# EasyEDA Pro project PCB3.epro

# Board PCB3
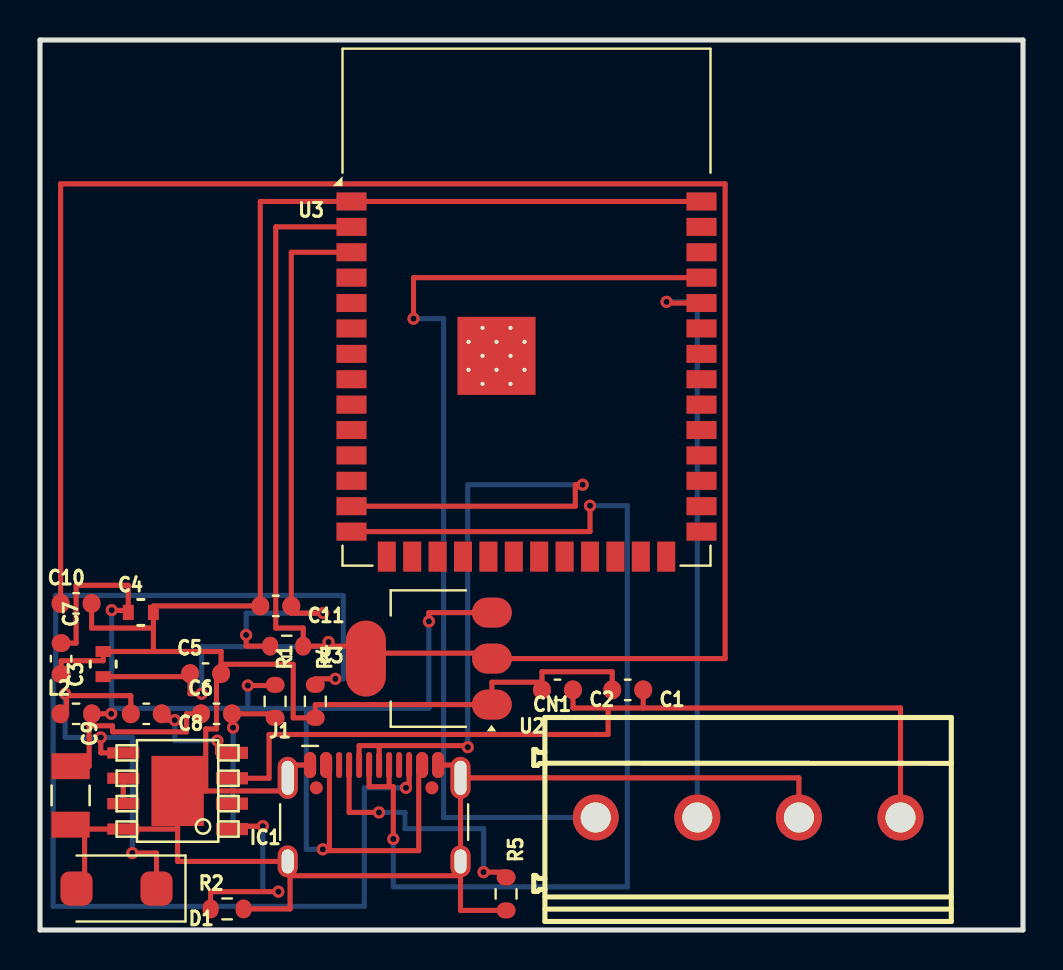
[diagram p0: board, top side]
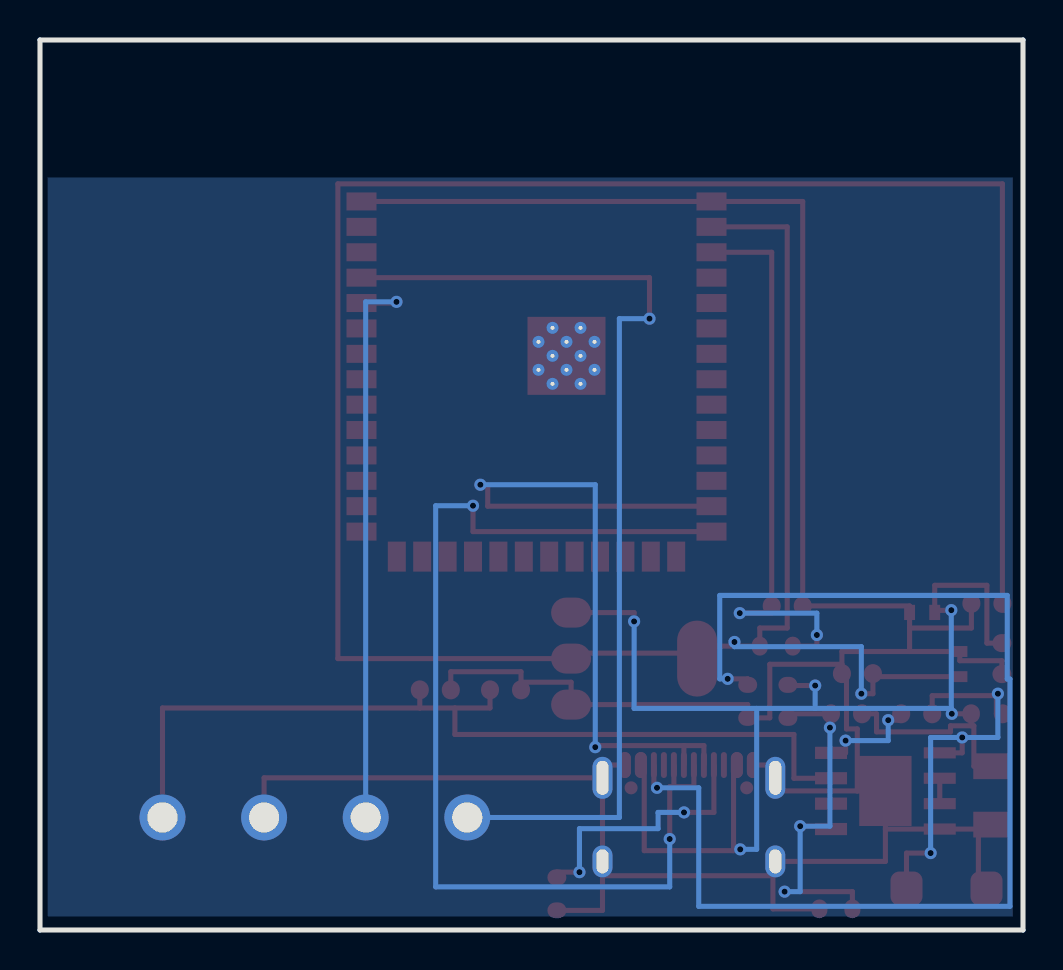
[diagram p1: board, bottom side, seen from below]

Outline 49.15 x 44.51 mm; copper layers: Top Layer, Bottom Layer. Coordinates in mm from the lower left corner of the outline.
Outline path: 0,44.51 49.15,44.51 49.15,0 0,0 0,44.51
Stack: Top Layer 0.035mm / Dielectric1 1.51mm FR4 er 4.5 / Bottom Layer 0.035mm

## Design rules (mm)
template: Custom Config
spacing copperThickness1oz (default): track to track 0.102, other pairs 0.1 to 0.3
spacing copperThickness2oz: track to track 0.203, other pairs 0.152 to 0.3
track width copperThickness1oz (default): min 0.127, default 0.254, max 2.54
track width copperThickness2oz: min 0.203, default 0.254, max 2.54
differential pair differentialPair (default): width min 0.127, default 0.254, max 2.54; gap min 0.152, default 0.152
via viaSize (default): diameter min 0.5, default 0.61, max 10; hole min 0.3, default 0.305, max 6.3

## Placement (name value [footprint] x y rotation side)
C1  -  [Capacitor_SMD:C_0603_1608Metric]  29.38 12.01 180 top
C2  -  [Capacitor_SMD:C_0603_1608Metric]  25.87 12.01 180 top
C3  -  [CAP:CAP_A106MMUAJ6_AVX]  3.16 13.3 90 top
C4  -  [CAP:CAP_A106MMUAJ6_AVX]  5.04 15.88 0 top
C5  -  [Capacitor_SMD:C_0603_1608Metric]  8.28 12.82 0 top
C6  -  [Capacitor_SMD:C_0603_1608Metric]  8.82 10.81 0 top
C7  -  [Capacitor_SMD:C_0603_1608Metric]  1.06 13.57 270 top
C8  -  [Capacitor_SMD:C_0603_1608Metric]  5.31 10.81 180 top
C9  -  [CAP:CAPC3216X190N]  1.53 6.73 270 top
C10  -  [Capacitor_SMD:C_0603_1608Metric]  1.81 16.33 0 top
C11  -  [Capacitor_SMD:C_0603_1608Metric]  11.79 16.2 180 top
CN1  DB128V-5.08-4P-GN-S  [CONN-TH_4P-P5.08_DIBO_DB128V-5.08]  35.41 5.63 0 top
D1  -  [DIODE:P25_DO-214AC_SMA]  5.83 2.07 180 top
IC1  -  [Buck convertor:SOIC-8EP]  6.88 6.95 180 top
J1  -  [Connector_USB:USB_C_Receptacle_HCTL_HC-TYPE-C-16P-01A]  16.71 4.5 0 top
L2  -  [Inductor_SMD:L_0603_1608Metric]  1.81 10.81 0 top
R1  -  [Resistor_SMD:R_0603_1608Metric]  11.75 11.43 270 top
R2  -  [Resistor_SMD:R_0603_1608Metric]  9.35 1.06 0 top
R3  -  [Resistor_SMD:R_0603_1608Metric]  12.34 14.19 180 top
R4  -  [Resistor_SMD:R_0603_1608Metric]  13.76 11.43 270 top
R5  -  [Resistor_SMD:R_0603_1608Metric]  23.31 1.8 270 top
U2  -  [Package_TO_SOT_SMD:SOT-223-3_TabPin2]  19.44 13.57 180 top
U3  -  [RF_Module:ESP32-S3-WROOM-1]  24.32 31.17 0 top

## Footprints (pads in the part's own frame, mm; a bottom-side part is the same pattern mirrored in y, then rotated)
Buck convertor:SOIC-8EP
  rect 1.6x0.61 smd: 1(-2.718,1.905) 2(-2.718,0.635) 3(-2.718,-0.635) 4(-2.718,-1.905)
  rect 1.6x0.559 smd: 5(2.718,-1.905) 6(2.718,-0.635) 7(2.718,0.635) 8(2.718,1.905)
  rect 2.616x3.505 smd: 9(0,0)
CAP:CAP_A106MMUAJ6_AVX
  rect 0.546x0.762 smd: 1(-0.628,0) 2(0.628,0)
CAP:CAPC3216X190N
  rect 1.29x1.91 smd: 1(-1.46,0) 2(1.46,0)
Capacitor_SMD:C_0603_1608Metric
  rrect 0.9x0.95 smd: 1(-0.775,0) 2(0.775,0)
CONN-TH_4P-P5.08_DIBO_DB128V-5.08
  round 2.3 hole 1.5: 1(-7.62,0) 2(-2.54,0) 3(2.54,0) 4(7.62,0)
Connector_USB:USB_C_Receptacle_HCTL_HC-TYPE-C-16P-01A
  round 0.65 smd: (-2.89,2.605) (2.89,2.605)
  rrect 0.6x1.3 smd: A1(-3.2,3.745) A4(-2.4,3.745) A9(2.4,3.745) A12(3.2,3.745) B1(3.2,3.745) B4(2.4,3.745) B9(-2.4,3.745) B12(-3.2,3.745)
  rrect 0.3x1.3 smd: A5(-1.25,3.745) A6(-0.25,3.745) A7(0.25,3.745) A8(1.25,3.745) B5(1.75,3.745) B6(0.75,3.745) B7(-0.75,3.745) B8(-1.75,3.745)
  oval 1x2.1 hole 0.6x1.7: S1(-4.32,3.105) S1(4.32,3.105)
  oval 1x1.6 hole 0.6x1.2: S1(-4.32,-1.075) S1(4.32,-1.075)
DIODE:P25_DO-214AC_SMA
  rrect 1.6x1.7 smd: 1(0,0) 2(4,0)
Inductor_SMD:L_0603_1608Metric
  rrect 0.875x0.95 smd: 1(-0.787,0) 2(0.787,0)
Package_TO_SOT_SMD:SOT-223-3_TabPin2
  rrect 2x1.5 smd: 1(-3.15,2.3) 2(-3.15,0) 3(-3.15,-2.3)
  rrect 2x3.8 smd: 2(3.15,0)
Resistor_SMD:R_0603_1608Metric
  rrect 0.8x0.95 smd: 1(-0.825,0) 2(0.825,0)
RF_Module:ESP32-S3-WROOM-1
  rect 0.9x0.9 smd: (-2.9,-1.06) (-2.9,-2.46) (-2.9,-3.86) (-1.5,-1.06) (-1.5,-2.46) (-1.5,-3.86) (-0.1,-1.06) (-0.1,-2.46) (-0.1,-3.86)
  rect 1.5x0.9 smd: 1(-8.75,5.26) 2(-8.75,3.99) 3(-8.75,2.72) 4(-8.75,1.45) 5(-8.75,0.18) 6(-8.75,-1.09) 7(-8.75,-2.36) 8(-8.75,-3.63) 9(-8.75,-4.9) 10(-8.75,-6.17) 11(-8.75,-7.44) 12(-8.75,-8.71) 13(-8.75,-9.98) 14(-8.75,-11.25) 27(8.75,-11.25) 28(8.75,-9.98) 29(8.75,-8.71) 30(8.75,-7.44) 31(8.75,-6.17) 32(8.75,-4.9) 33(8.75,-3.63) 34(8.75,-2.36) 35(8.75,-1.09) 36(8.75,0.18) 37(8.75,1.45) 38(8.75,2.72) 39(8.75,3.99) 40(8.75,5.26)
  rect 0.9x1.5 smd: 15(-6.985,-12.5) 16(-5.715,-12.5) 17(-4.445,-12.5) 18(-3.175,-12.5) 19(-1.905,-12.5) 20(-0.635,-12.5) 21(0.635,-12.5) 22(1.905,-12.5) 23(3.175,-12.5) 24(4.445,-12.5) 25(5.715,-12.5) 26(6.985,-12.5)
  round 0.6 hole 0.2: 41(-2.9,-1.76) 41(-2.9,-3.16) 41(-2.2,-1.06) 41(-2.2,-2.46) 41(-2.2,-3.86) 41(-1.5,-1.76) 41(-1.5,-3.16) 41(-0.8,-1.06) 41(-0.8,-2.46) 41(-0.8,-3.86) 41(-0.1,-1.76) 41(-0.1,-3.16)
  rect 3.9x3.9 smd: 41(-1.5,-2.46)

## Nets
5V_SUP: C4.1 C6.1 C7.1 C9.1 J1.A4 J1.A9 J1.B4 J1.B9 L2.2 R1.1 U2.3
D+: J1.A6 J1.B6 U3.14
D-: J1.A7 J1.B7 U3.13
EN: C11.1 R3.2 U3.3
POWER_+3V3: C3.1 C5.1 C10.1 R3.1 U2.2 U3.2
POWER_GND: C1.2 C2.2 C3.2 C4.2 C5.2 C7.2 C9.2 C10.2 C11.2 CN1.3 D1.2 IC1.8 IC1.9 J1.A1 J1.A12 J1.B1 J1.B12 J1.S1 R2.2 R4.2 R5.2 U2.1 U3.1 U3.40 U3.41
$1N4: C8.2 D1.1 IC1.5 L2.1
$1N6: C1.1 C2.1 CN1.4 IC1.3
$1N11: IC1.6 IC1.7
$1N14: CN1.1 U3.37
$1N16: CN1.2 U3.36
$1N23: C6.2 IC1.1 R1.2 R2.1
$1N25: C8.1 IC1.4
$1N30: J1.A5 R5.1
$1N40: J1.B5 R4.1

Pads without a net: IC1 2; J1 A8 B8; U3 4 5 6 7 8 9 10 11 12 15 16 17 18 19 20 21 22 23 24 25 26 27 28 29 30 31 32 33 34 35 38 39

## Via types
v1: diameter 0.61, hole 0.305, Top Layer to Bottom Layer, 27 vias

## Routing (per net, layer and track width the routed paths; a pad name or vN(x,y) marks a point on that pad's centre or on a via; arc(x,y) is an arc through that point)
5V_SUP: length 72.9
  Top Layer w0.254: U2.3 19.44,15.87 v1(19.44,15.43) ; v1(10.39,12.22) 11.75,12.22 R1.1 ; C6.1 7.32,10.81 7.32,9.91 3.62,9.91 3.62,10.21 2.59,10.21 ; 19.1,8.25 18.94,8.25 18.94,3.97 14.47,3.97 14.47,4.03 ; 4.41,15.98 3.58,15.98 v1(3.58,16) ; 4.41,15.98 4.41,15.88 ; 4.41,15.98 4.41,17.24 1.81,17.24 1.81,14.35 C7.1 ; 2.59,10.21 2.46,10.21 2.46,8.19 C9.1 ; 2.59,10.21 L2.2 v1(3.56,10.81) ; 14.47,4.03 14.47,8.25 J1.A4 ; 14.47,4.03 v1(14.14,4.03)
  Bottom Layer w0.254: 3.58,11.08 10.39,11.08 ; 3.58,11.08 v1(3.58,16) ; 3.58,11.08 3.58,10.81 v1(3.56,10.81) ; 10.39,11.08 13.32,11.08 ; 10.39,11.08 v1(10.39,12.22) ; 13.32,11.08 19.44,11.08 v1(19.44,15.43) ; 13.32,11.08 13.32,4.03 v1(14.14,4.03)
D+: length 54.2
  Top Layer w0.254: v1(17.66,4.55) 17.66,7.17 17.46,7.17 ; U3.14 27.5,19.92 v1(27.5,21.22) ; 17.46,7.17 16.46,7.17 J1.A6 ; 17.46,7.17 J1.B6
  Bottom Layer w0.254: v1(17.66,4.55) 17.66,2.16 29.37,2.16 29.37,21.22 v1(27.5,21.22)
D-: length 39
  Top Layer w0.254: J1.A7 16.96,9.22 ; 16.96,9.22 21.39,9.22 v1(21.39,9.14) ; 16.96,9.22 15.96,9.22 J1.B7 ; v1(27.13,22.27) 26.76,22.27 26.76,21.19 U3.13
  Bottom Layer w0.254: v1(27.13,22.27) 21.39,22.27 v1(21.39,9.14)
EN: length 29.4
  Top Layer w0.254: U3.3 12.56,33.89 C11.1 12.56,15.85 v1(14.16,15.85) ; R3.2 10.31,14.19 v1(10.31,14.75)
  Bottom Layer w0.254: v1(14.16,15.85) 10.31,15.85 v1(10.31,14.75)
POWER_+3V3: length 141.1
  Top Layer w0.254: 16.29,13.85 16.29,14.19 14.43,14.19 ; 16.29,13.85 22.59,13.85 U2.2 34.26,13.57 34.26,37.31 1.03,37.31 C10.1 ; 16.29,13.85 U2.2 ; 7.5,12.67 7.5,11.82 v1(8.08,11.82) ; 7.5,12.67 C5.1 ; 7.5,12.67 C3.1 ; U3.2 11.79,35.16 11.79,15.1 13.16,15.1 R3.1 14.43,14.19 ; 14.43,14.19 v1(14.43,14.4)
  Bottom Layer w0.254: v1(14.43,14.4) 14.43,14.17 8.08,14.17 v1(8.08,11.82)
POWER_GND: length 165.7
  Top Layer w0.254: CN1.3 37.95,7.61 J1.S1 ; 13.5,8.25 12.38,8.25 12.38,6.95 8.29,6.95 ; C7.2 1.06,13.47 3.16,13.47 C3.2 5.67,13.93 ; 5.67,13.93 9.05,13.93 9.05,13.29 ; 5.67,13.93 5.67,15.1 ; 12.5,2.71 12.5,3.43 6.88,3.43 6.88,5.05 ; 12.5,2.71 12.5,1.06 R2.2 ; 12.5,2.71 21.03,2.71 ; C2.2 25.1,12.39 ; 25.1,12.39 22.59,12.39 U2.1 13.76,11.27 R4.2 12.66,10.61 12.66,13.29 9.05,13.29 ; 25.1,12.39 25.1,12.91 28.61,12.91 C1.2 ; 8.29,6.95 IC1.9 6.88,5.05 ; 8.29,6.95 8.29,10.05 8.82,10.05 8.82,12.82 C5.2 9.05,13.29 ; R5.2 21.03,0.98 21.03,2.71 ; 6.88,5.05 IC1.8 2.23,5.05 ; U3.40 U3.1 11.01,36.43 C11.2 5.67,16.2 C4.2 5.67,15.1 ; 2.23,5.05 2.23,2.07 D1.2 ; 2.23,5.05 1.53,5.05 C9.2 ; 21.03,2.71 J1.S1 J1.S1 ; 5.67,15.1 2.58,15.1 C10.2 ; J1.S1 21.03,8.25 J1.A12
$1N4: length 21.7
  Top Layer w0.254: 1.33,11.72 1.26,11.72 v1(1.26,11.82) ; 1.33,11.72 1.33,10.81 L2.1 ; 1.33,11.72 4.54,11.72 C8.2 ; IC1.5 3.04,8.86 v1(3.04,9.63) ; v1(4.62,3.85) 5.83,3.85 D1.1
  Bottom Layer w0.254: v1(1.26,11.82) 1.26,9.63 v1(3.04,9.63) 4.62,9.63 v1(4.62,3.85)
$1N6: length 46
  Top Layer w0.254: C2.1 26.65,11.1 28.41,11.1 ; 28.41,11.1 30.16,11.1 ; 28.41,11.1 28.41,9.78 11.45,9.78 11.45,7.59 IC1.3 ; 30.16,11.1 C1.1 ; 30.16,11.1 43.03,11.1 CN1.4
$1N11: length 1.3
  Top Layer w0.254: IC1.6 IC1.7
$1N14: length 50.5
  Top Layer w0.254: v1(18.68,30.57) 18.68,32.62 U3.37
  Bottom Layer w0.254: CN1.1 20.18,5.63 20.18,30.57 v1(18.68,30.57)
$1N16: length 29.1
  Top Layer w0.254: U3.36 31.33,31.35 v1(31.33,31.41)
  Bottom Layer w0.254: CN1.2 32.87,31.41 v1(31.33,31.41)
$1N23: length 19.5
  Top Layer w0.254: C6.2 9.65,10.81 ; 9.65,10.81 11.75,10.81 R1.2 ; 9.65,10.81 v1(9.65,10.12) ; v1(11.14,5.19) 9.6,5.19 IC1.1 ; v1(11.92,1.92) 8.53,1.92 R2.1
  Bottom Layer w0.254: v1(11.92,1.92) 11.14,1.92 v1(11.14,5.19) 9.65,5.19 v1(9.65,10.12)
$1N25: length 5.5
  Top Layer w0.254: v1(6.74,10.49) 6.09,10.49 C8.1 ; IC1.4 8.87,8.86 v1(8.87,9.47)
  Bottom Layer w0.254: v1(6.74,10.49) 6.74,9.47 v1(8.87,9.47)
$1N30: length 13.5
  Top Layer w0.254: J1.A5 15.46,5.88 v1(16.95,5.88) ; R5.1 23.31,2.89 v1(22.18,2.89)
  Bottom Layer w0.254: v1(16.95,5.88) 18.25,5.88 18.25,5.07 22.18,5.07 v1(22.18,2.89)
$1N40: length 60.8
  Top Layer w0.254: J1.B5 18.46,7.11 v1(18.3,7.11) ; R4.1 13.76,12.56 v1(14.77,12.56)
  Bottom Layer w0.254: v1(14.77,12.56) 15.16,12.56 15.16,16.73 0.79,16.73 0.79,12.55 0.65,12.55 0.65,1.18 16.21,1.18 16.21,7.11 v1(18.3,7.11)

## Copper pours and planes (outline as drawn; the poured copper is in the pictures)
POWER_GND on Bottom Layer: 0.51,37.63 48.77,37.63 48.77,0.68 0.51,0.68
